# Altium schematic sheet Sheet1.SchDoc
size A
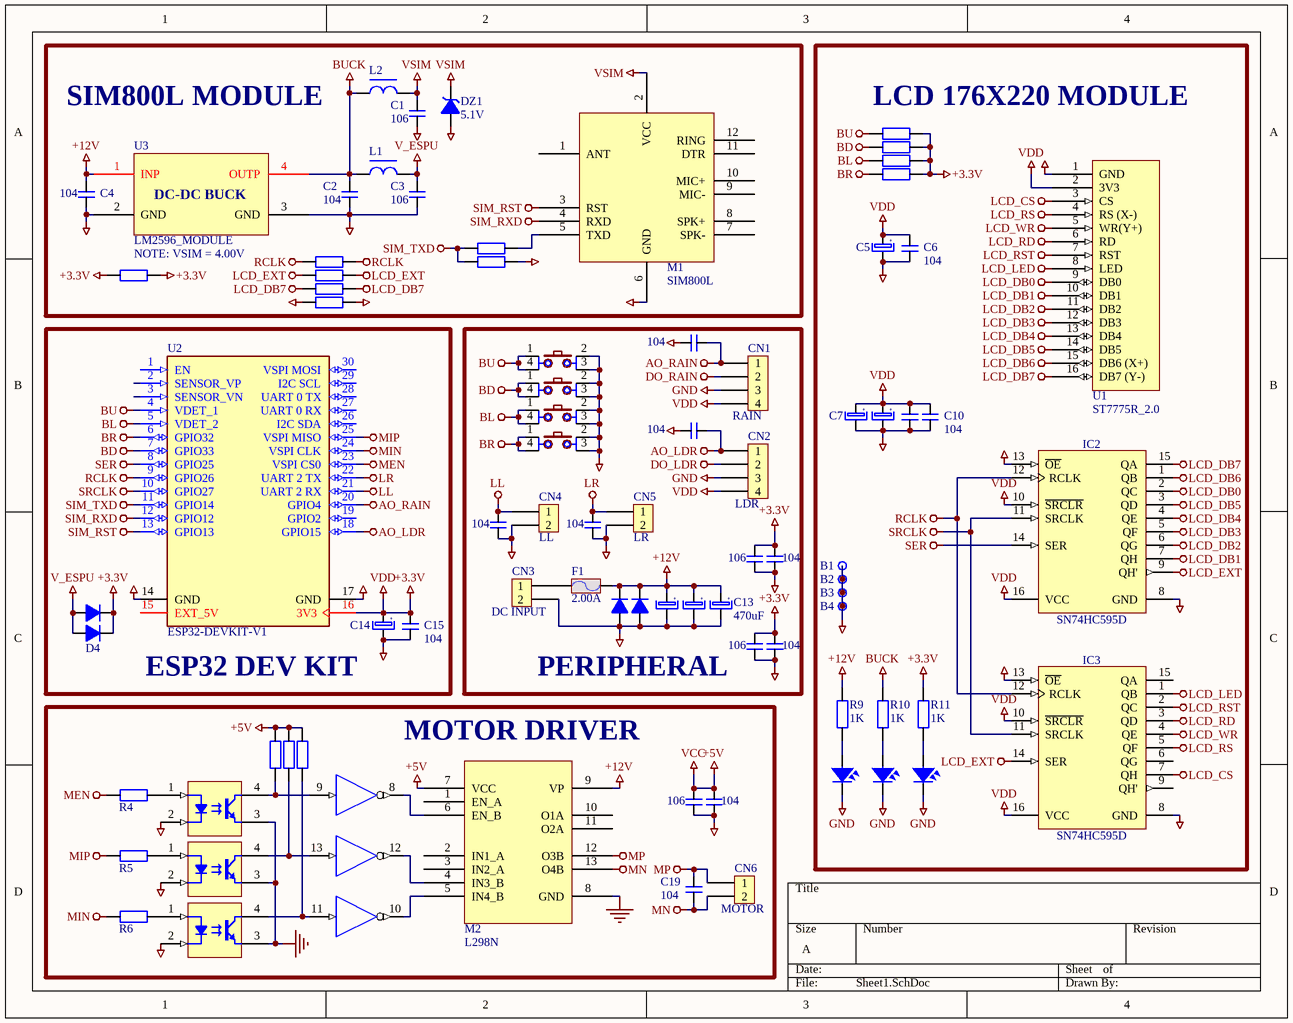
[diagram p0: Sheet1.SchDoc]

## Parts
B1  Plated Hole  [MTG300_600]  (value not drawn)
B2  Plated Hole  [MTG300_600]  (value not drawn)
B3  Plated Hole  [MTG300_600]  (value not drawn)
B4  Plated Hole  [MTG300_600]  (value not drawn)
C1  106  [CAP-SMD-0805]
C2  104  [Cap-Non-150mil]
C3  106  [CAP-SMD-0805]
C4  104  [Cap-Non-150mil]
C5  220uF  [Cap-P-2.5/5]  (value not drawn)
C6  104  [Cap-Non-150mil]
C7  220uF  [Cap-P-2.5/5]  (value not drawn)
C8  220uF  [Cap-P-2.5/5]  (value not drawn)
C9  104  [Cap-Non-150mil]  (value not drawn)
C10  104  [Cap-Non-150mil]
C11  470uF  [Cap-P-3.8/6.3]  (value not drawn)
C12  470uF  [Cap-P-3.8/6.3]  (value not drawn)
C13  470uF  [Cap-P-3.8/6.3]
C14  220uF  [Cap-P-2.5/5]  (value not drawn)
C15  104  [Cap-Non-150mil]
C16  106  [CAP-SMD-0805]
C17  104  [CAP-SMD-0805]
C18  104  [CAP-SMD-0805]
C19  104  [CAP-SMD-0805]
C20  104  [CAP-SMD-0805]
C21  104  [CAP-SMD-0805]
C22  104  [CAP-SMD-0805]
C23  106  [CAP-SMD-0805]
C24  104  [CAP-SMD-0805]
C25  106  [CAP-SMD-0805]
C26  104  [CAP-SMD-0805]
CN1  RAIN  [Header 4P]
CN2  LDR  [Header 4P]
CN3  DC INPUT  [KF2/5.08]
CN4  LL  [Header 2P]
CN5  LR  [Header 2P]
CN6  MOTOR  [KF2/5.08]
D1  SS14  [SOD 106]  (value not drawn)
D2  SS14  [SOD 106]  (value not drawn)
D3  SS14  [SOD 106]  (value not drawn)
D4  SS14  [SOD 106]  (value not drawn)
DZ1  5.1V  [Diode-Zenner-200mil]
F1  2.00A  [Fuse-Dip1]
IC1  FOD817DSD  [DIP4]  (value not drawn)
IC2  SN74HC595D  [SOIC127P600X175-16N]
IC3  SN74HC595D  [SOIC127P600X175-16N]
IC4  FOD817DSD  [DIP4]  (value not drawn)
IC5  FOD817DSD  [DIP4]  (value not drawn)
IC6  74HC14D  [SOIC127P600X175-14N]  (value not drawn)  (parts D,E,F of 6)
L1  470uH  [L-DIP-M-5.3]  (value not drawn)
L2  470uH  [L-DIP-M-5.3]  (value not drawn)
LED1  POWER  [LED-0805]  (value not drawn)
LED2  ESP-5.0V  [LED-0805]  (value not drawn)
LED3  ESP-3.3V  [LED-0805]  (value not drawn)
M1  SIM800L  [SIM800L_M]
M2  L298N  [L298N_MODULE]
R1  1K  [RES-SMD-0805]  (value not drawn)
R2  1K  [RES-SMD-0805]  (value not drawn)
R3  1K  [RES-SMD-0805]  (value not drawn)
R4  1K  [RES-SMD-0805]  (value not drawn)
R5  1K  [RES-SMD-0805]  (value not drawn)
R6  1K  [RES-SMD-0805]  (value not drawn)
R7  1K  [RES-SMD-0805]  (value not drawn)
R8  1K  [RES-SMD-0805]  (value not drawn)
R9  1K  [RES-SMD-0805]
R10  1K  [RES-SMD-0805]
R11  1K  [RES-SMD-0805]
R13  0R  [RES-SMD-0805]  (value not drawn)
R14  0R  [RES-SMD-0805]  (value not drawn)
R15  0R  [RES-SMD-0805]  (value not drawn)
R16  0R  [RES-SMD-1206]  (value not drawn)
R17  1K  [RES-SMD-0805]  (value not drawn)
R21  1K  [RES-SMD-0805]  (value not drawn)
R22  1K  [RES-SMD-0805]  (value not drawn)
R23  1K  [RES-SMD-0805]  (value not drawn)
R27  0R  [RES-SMD-1206]  (value not drawn)
SW1  UP  [Button-Dip4/6x6]  (value not drawn)
SW2  DOWN  [Button-Dip4/6x6]  (value not drawn)
SW3  LEFT  [Button-Dip4/6x6]  (value not drawn)
SW4  RIGHT  [Button-Dip4/6x6]  (value not drawn)
U1  ST7775R_2.0  [LCD_176X220_MODULE]
U2  ESP32-DEVKIT-V1  [MODULE_ESP32-DEVKITC-32D]
U3  LM2596_MODULE  [LM2596_MODULE]

## Blocks framed on the sheet
SIM800L MODULE: C1-C4 DZ1 L1 L2 M1 R7 R8 R13-R16 R27 U3
LCD 176X220 MODULE: B1-B4 C5-C10 IC2 IC3 LED1-LED3 R9-R11 R17 R21-R23 U1
ESP32 DEV KIT: C14 C15 D1 D4 U2
PERIPHERAL: C11-C13 C18 C20-C26 CN1-CN5 D2 D3 F1 SW1-SW4
MOTOR DRIVER: C16 C17 C19 CN6 IC1 IC4-IC6 M2 R1-R6

## Nets
+3.3V: C5.1 C6.2 C7.1 C8.1 C9.2 C10.2 C14.1 C15.2 C23.2 C24.2 C25.2 C26.2 CN1.4 CN2.4 D1.2(K) D4.2(K) IC2.10(~{SRCLR}) IC2.16(VCC) IC3.10(~{SRCLR}) IC3.16(VCC) R11.2 R17.1 R21.1 R22.1 R23.1 R27.1 R27.2 U1.2(3V3) U2.16(3V3)  [also labelled VDD]
+5V: C16.2 C17.2 IC6.14(VCC) M2.7(VCC) R1.2 R2.2 R3.2  [also labelled VCC]
+12V: C4.1 C11.1 C12.1 C13.1 D2.2(K) D3.2(K) F1.2 M2.9(VP) R9.2 U3.1(INP)
AO_LDR: C22.1 CN2.1 U2.18(GPIO15)
AO_RAIN: C21.1 CN1.1 U2.20(GPIO4)
BD: R17.2 SW2.1 SW2.4 U2.7(GPIO33)
BL: R22.2 SW3.1 SW3.4 U2.5(VDET_2)
BR: R21.2 SW4.1 SW4.4 U2.6(GPIO32)
BU: R23.2 SW1.1 SW1.4 U2.4(VDET_1)
BUCK: C2.1 L1.1 L2.1 R10.2 U3.4(OUTP)
DO_LDR: CN2.2
DO_RAIN: CN1.2
GND: B1.1 B2.1 B3.1 B4.1 C1.1 C2.2 C3.1 C4.2 C5.2 C6.1 C7.2 C8.2 C9.1 C10.1 C11.2 C12.2 C13.2 C14.2 C15.1 C16.1 C17.1 C18.2 C20.2 C21.2 C22.2 C23.1 C24.1 C25.1 C26.1 CN1.3 CN2.3 CN3.2 CN4.2 CN5.2 D2.1(A) D3.1(A) DZ1.1(A) IC1.2(C) IC1.3(E) IC2.8(GND) IC2.13(~{OE}) IC3.8(GND) IC3.13(~{OE}) IC4.2(C) IC4.3(E) IC5.2(C) IC5.3(E) IC6.7(GND) LED1.2 LED2.2 LED3.2 M1.6(GND) M2.8(GND) R8.1 R16.1 R16.2 SW1.2 SW1.3 SW2.2 SW2.3 SW3.2 SW3.3 SW4.2 SW4.3 U1.1(GND) U2.14(GND) U2.17(GND) U3.2(GND) U3.3(GND)
LCD_CS: IC3.7(QH) U1.3(CS)
LCD_DB0: IC2.2(QC) U1.9(DB0)
LCD_DB1: IC2.7(QH) U1.10(DB1)
LCD_DB2: IC2.6(QG) U1.11(DB2)
LCD_DB3: IC2.5(QF) U1.12(DB3)
LCD_DB4: IC2.4(QE) U1.13(DB4)
LCD_DB5: IC2.3(QD) U1.14(DB5)
LCD_DB6: IC2.1(QB) U1.15(DB6_(X+))
LCD_DB7: IC2.15(QA) R15.1 R15.2 U1.16(DB7_(Y-))
LCD_EXT: IC2.9(QH') IC3.14(SER) R14.1 R14.2
LCD_LED: IC3.1(QB) U1.8(LED)
LCD_RD: IC3.3(QD) U1.6(RD)
LCD_RS: IC3.5(QF) U1.4(RS_(X-))
LCD_RST: IC3.2(QC) U1.7(RST)
LCD_WR: IC3.4(QE) U1.5(WR(Y+))
LL: C18.1 CN4.1 U2.21(UART_2_RX)
LR: C20.1 CN5.1 U2.22(UART_2_TX)
MEN: R4.2 U2.23(VSPI_CS0)
MIN: R6.2 U2.24(VSPI_CLK)
MIP: R5.2 U2.25(VSPI_MISO)
MN: C19.1 CN6.2 M2.13(O4B)
MP: C19.2 CN6.1 M2.12(O3B)
RCLK: IC2.12(RCLK) IC3.12(RCLK) R13.1 R13.2 U2.9(GPIO26)
SER: IC2.14(SER) U2.8(GPIO25)
SIM_RST: M1.3(RST) U2.13(GPIO13)
SIM_RXD: M1.4(RXD) U2.12(GPIO12)
SIM_TXD: R7.1 R8.2 U2.11(GPIO14)
SRCLK: IC2.11(SRCLK) IC3.11(SRCLK) U2.10(GPIO27)
V_ESPU: C3.2 D1.1(A) D4.1(A) L1.2
VSIM: C1.2 DZ1.2(K) L2.2 M1.2(VCC)
NetCN3_1: CN3.1 F1.1
NetIC1_1: IC1.1(A) R4.1
NetIC1_4: IC1.4(C) IC6.9(IN) R1.1
NetIC4_1: IC4.1(A) R5.1
NetIC4_4: IC4.4(C) IC6.13(IN) R2.1
NetIC5_1: IC5.1(A) R6.1
NetIC5_4: IC5.4(C) IC6.11(IN) R3.1
NetIC6_8: IC6.8(OUT) M2.6(EN_B)
NetIC6_10: IC6.10(OUT) M2.5(IN4_B)
NetIC6_12: IC6.12(OUT) M2.4(IN3_B)
NetLED1_1: LED1.1 R9.1
NetLED2_1: LED2.1 R10.1
NetLED3_1: LED3.1 R11.1
NetM1_5: M1.5(TXD) R7.2

Not connected (* = marked no-connect by the designer): IC3 6(QG) 9(QH') 15(QA); M1 1(ANT) 7(SPK-) 8(SPK+) 9(MIC-) 10(MIC+) 11(DTR) 12(RING); M2 1(EN_A) 2(IN1_A) 3(IN2_A) 10(O1A) 11(O2A); U2 1(EN) 2(SENSOR_VP) 3(SENSOR_VN) 15(EXT_5V) 19(GPIO2) 26(I2C_SDA) 27(UART_0_RX) 28(UART_0_TX) 29(I2C_SCL) 30(VSPI_MOSI)

## Notes on the sheet
- (near R27) NOTE: VSIM = 4.00V
- (in symbol Cap-Pol-Dip) +
- (in symbol LM2596_MODULE) DC-DC BUCK

## Library data of the parts
B1-B4 = PLATED_HOLE3.0_PAD6.0: Single Terminal Socket; Part Description: Plated Through Hole: Hole Dia.=3.0mm Pad Dia.=6.0mm; Mounted: No; Part Number: PLATED_HOLE3.0_PAD6.0; Component Kind: Standard (No BOM); Component Type: Standard (No BOM); Pin Count: 1; Family: Plated Hole; Socket: No; SMD: No; Sense: No; Status: None; ComponentHeight: 0mm; HelpURL: Undefined; Author: CERN DEM JLC; CreateDate: 5/26/2008; LatestRevisionDate: 5/26/2008; PackageDescription: Plated Through Hole: Hole Dia.=3.0mm Pad Dia.=6.0mm
C1 C3 C16-C18 C20-C26 = Cap-Non-SMD: Non-polar capacitor
C2 C4 C6 C9 C10 C15 C19 = Cap-Non-Dip: Non-polar capacitor
C5 C7 C8 C11-C14 = Cap-Pol-Dip: Polarized capacitor
CN1 CN2 = Header 4
CN3 CN6 = KF 2
CN4 CN5 = Header 2
D1-D4 = Diode SMD
DZ1 = Diode Zenner: Value: 3v3
F1 = Fuse Dip
IC1 IC4 IC5 = FOD817DSD: Single Optocoupler; Part Description: 4-Pin High Operating Temperature Phototransistor Optocoupler; Manufacturer: FAIRCHILD SEMICONDUCTOR; PressFit: No; Bonding: No; Part Number: FOD817DSD; Component Kind: Standard; Component Type: Standard; Device: FOD817DSD; Footprint: FAIRCHILD_FOD817DSD; PackageDescription: SOIC, 2.54mm Pitch, 4 Pin, Body 6.5mm W X 4.6mm L X 4.6mm H; Manufacturer Part Number: FOD817DSD; Pin Count: 4; Case: SOIC4; Mounted: Yes; Socket: No; SMD: Yes; Sense: No; ComponentHeight: 4.6mm; HelpURL: \\cern.ch\dfs\Applications\Altium\Datasheets\FOD817DSD.pdf; Author: CERN DEM JLC; CreateDate: 7/21/2014; LatestRevisionDate: 7/21/2014
IC2 IC3 = SN74HC595D: 8-Bit Shift Register With 3-State Output Register; Part Description: 8-Bit Shift Register With 3-State Output Registers; Manufacturer: TEXAS INSTRUMENTS; PressFit: No; Bonding: No; Part Number: SN74HC595D; Component Kind: Standard; Component Type: Standard; Device: SN74HC595D; PackageDescription: SOIC 16, Pitch 1.27mm - Body 4x10mm, IPC Medium Density; Manufacturer Part Number: SN74HC595D; Pin Count: 16; Case: SOIC16; Mounted: Yes; Socket: No; SMD: Yes; Sense: No; ComponentHeight: 1.75mm; Author: CERN DEM JLC; HelpURL: \\cern.ch\dfs\Applications\Altium\Datasheets\SN74HC595D.pdf; CreateDate: 6/5/2012; LatestRevisionDate: 6/5/2012
IC6 = 74HC14D: Hex Schmitt-Trigger Inverter; Part Description: Hex  Inverterting Schmitt-Trigger; Manufacturer: NXP SEMICONDUCTORS; PressFit: No; Bonding: No; Part Number: 74HC14D; Component Kind: Standard; Component Type: Standard; Device: 74HC14D; PackageDescription: SOIC 14, Pitch 1.27mm - Body 4x8.75mm, IPC Medium Density; Manufacturer Part Number: 74HC14D; Pin Count: 14; Case: SOIC14; Mounted: Yes; Socket: No; SMD: Yes; Sense: No; ComponentHeight: 1.75mm; Author: CERN DEM JLC; HelpURL: \\cern.ch\dfs\Applications\Altium\Datasheets\74HC14D.pdf; CreateDate: 8/26/2014; LatestRevisionDate: 8/26/2014
L1 L2 = IND-DIP-1: Inductor; Value: 150 mH
LED1-LED3 = LED_SMD
R1-R11 R17 R21-R23 R27 = Res 1/4W: Resistor 1/4W
R13-R16 = Res SMD: Resistor SMD
SW1-SW4 = Button-4: Switch button 4 pin; Value: Button chip 4 pin
U1 = LCD_176x220_ST7775R: ComponentLink1Description: Wiki; ComponentLink1URL: http://www.lcdwiki.com/2.8inch_SPI_Module_ILI9341_SKU:MSP2807
U2 = ESP32-DEVKIT-V1: - Transceiver; 802.11 b/g/n _Wi-Fi, WiFi, WLAN_, Bluetooth® Smart Ready 4.x Dual Mode For Use With ESP-WROOM-32; MF: Espressif Systems; MP: ESP32-DEVKITC-32D; Package: None; Price: None; Availability: Unavailable; SnapEDA_Link: https://www.snapeda.com/parts/ESP32-DEVKITC-32D/Espressif%20Systems/view-part/2777395/?ref=snap; Value: *
U3 = LM2596_MODULE: ComponentLink1Description: DATASHEET; ComponentLink1URL: http://tpelectronic.ir/datasheets/20150123144301750.pdf